# EAGLE design Ponte_H_L293E (EAGLE 9.6.2)

## Sheet 1 of 2
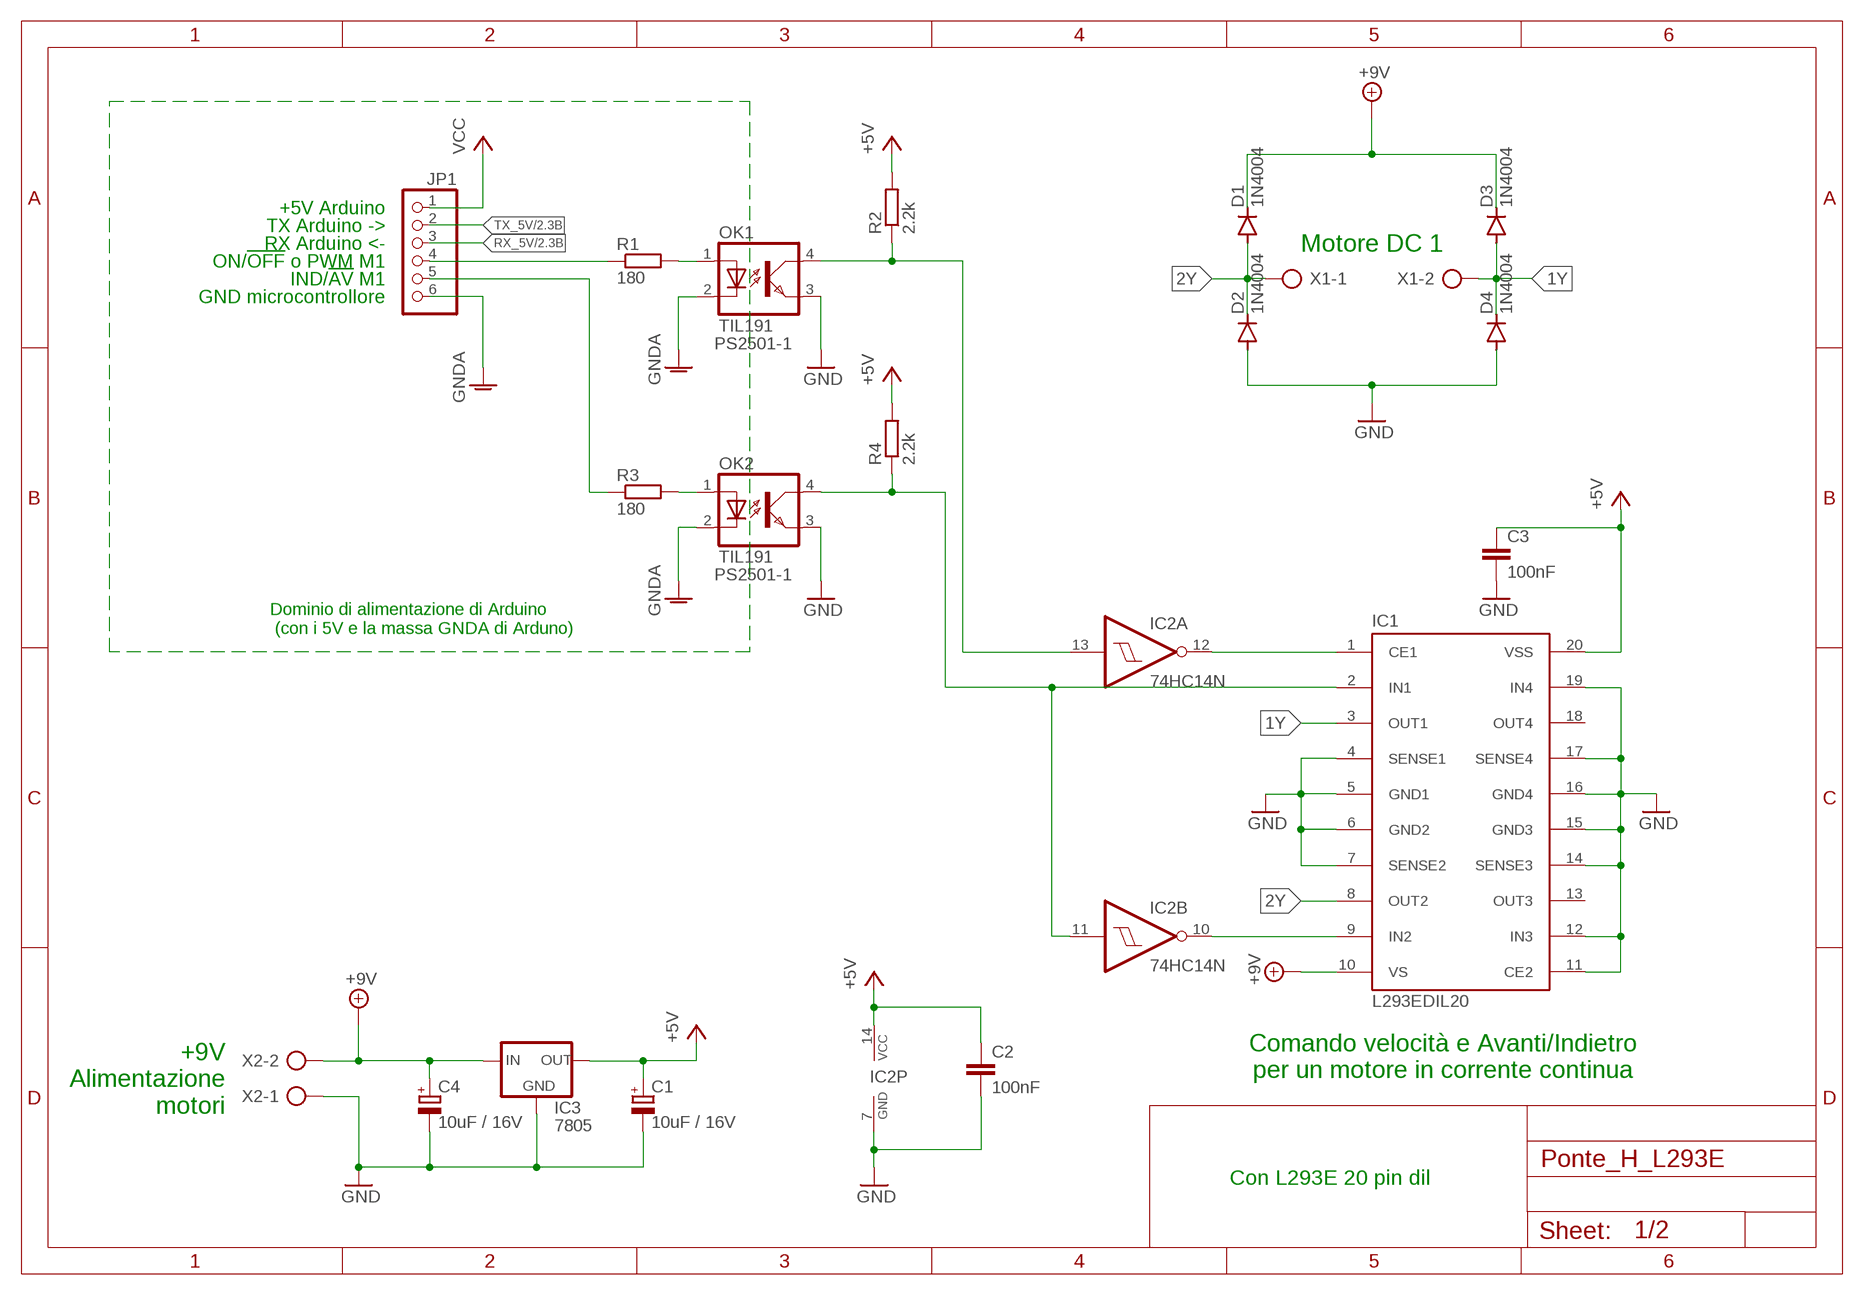
[diagram p0: schematic, sheet 1]

### Parts
C1  10uF / 16V  CPOL-EUE5-8.5  [E5-8,5]
C2  100nF  C-EU050-025X075  [C050-025X075]
C3  100nF  C-EU050-025X075  [C050-025X075]
C4  10uF / 16V  CPOL-EUE5-8.5  [E5-8,5]
D1  1N4004  [DO41-10]
D2  1N4004  [DO41-10]
D3  1N4004  [DO41-10]
D4  1N4004  [DO41-10]
IC1  L293EDIL20  [DIL20]
IC2  74HC14N  [DIL14]
IC3  7805  78XXS  [78XXS]
JP1  PINHD-1X6  [1X06]
OK1  TIL191  [DIL04]
OK2  TIL191  [DIL04]
R1  180  R-EU_0207/10  [0207/10]
R2  2.2k  R-EU_0207/10  [0207/10]
R3  180  R-EU_0207/10  [0207/10]
R4  2.2k  R-EU_0207/10  [0207/10]
X1  AK500/2  [AK500/2]
X2  AK500/2  [AK500/2]

### Nets
1Y [pwr]: D3.A D4.C IC1.3(OUT1) X1.2
2Y [pwr]: D1.A D2.C IC1.8(OUT2) X1.1
+5V [aa]: C1.+ C2.1 C3.1 IC1.20(VSS) IC2.14(P:VCC) IC3.OUT R2.2 R4.2
+9V [pwr]: C4.+ D1.C D3.C IC1.10(VS) IC3.IN X2.2
GND [pwr]: C1.- C2.2 C3.2 C4.- D2.A D4.A IC1.4(SENSE1) IC1.5(GND1) IC1.6(GND2) IC1.7(SENSE2) IC1.11(CE2) IC1.12(IN3) IC1.14(SENSE3) IC1.15(GND3) IC1.16(GND4) IC1.17(SENSE4) IC1.19(IN4) IC2.7(P:GND) IC3.GND OK1.3(EMIT) OK2.3(EMIT) X2.1
GNDA: JP1.6 OK1.2(C) OK2.2(C) ; also sheet 2
I/!A!: JP1.5 R3.1
N$1: IC1.1(CE1) IC2.12(A:O)
N$2: IC1.2(IN1) IC2.11(B:I) OK2.4(COL) R4.1
N$3: OK2.1(A) R3.2
N$4: IC1.9(IN2) IC2.10(B:O)
N$5: OK1.1(A) R1.2
N$11: IC2.13(A:I) OK1.4(COL) R2.1
PWM: JP1.4 R1.1
RX_5V: JP1.3 ; also sheet 2
TX_5V: JP1.2 ; also sheet 2
VCC: JP1.1 ; also sheet 2
Unconnected: IC1.13(OUT3) IC1.18(OUT4) IC2.1(D:I) IC2.2(D:O) IC2.3(E:I) IC2.4(E:O) IC2.5(F:I) IC2.6(F:O) IC2.8(C:O) IC2.9(C:I)

### Notes on the sheet
- +5V Arduino
- TX Arduino ->
- RX Arduino <-
- Motore DC 1
- ON/!OFF! o PWM M1
- IND/!AV! M1
- GND microcontrollore
- Dominio di alimentazione di Arduino
   (con i 5V e la massa GNDA di Arduno)
- +9V
  Alimentazione
  motori
- Comando velocità e Avanti/Indietro
  per un motore in corrente continua
- Con L293E 20 pin dil

## Sheet 2 of 2
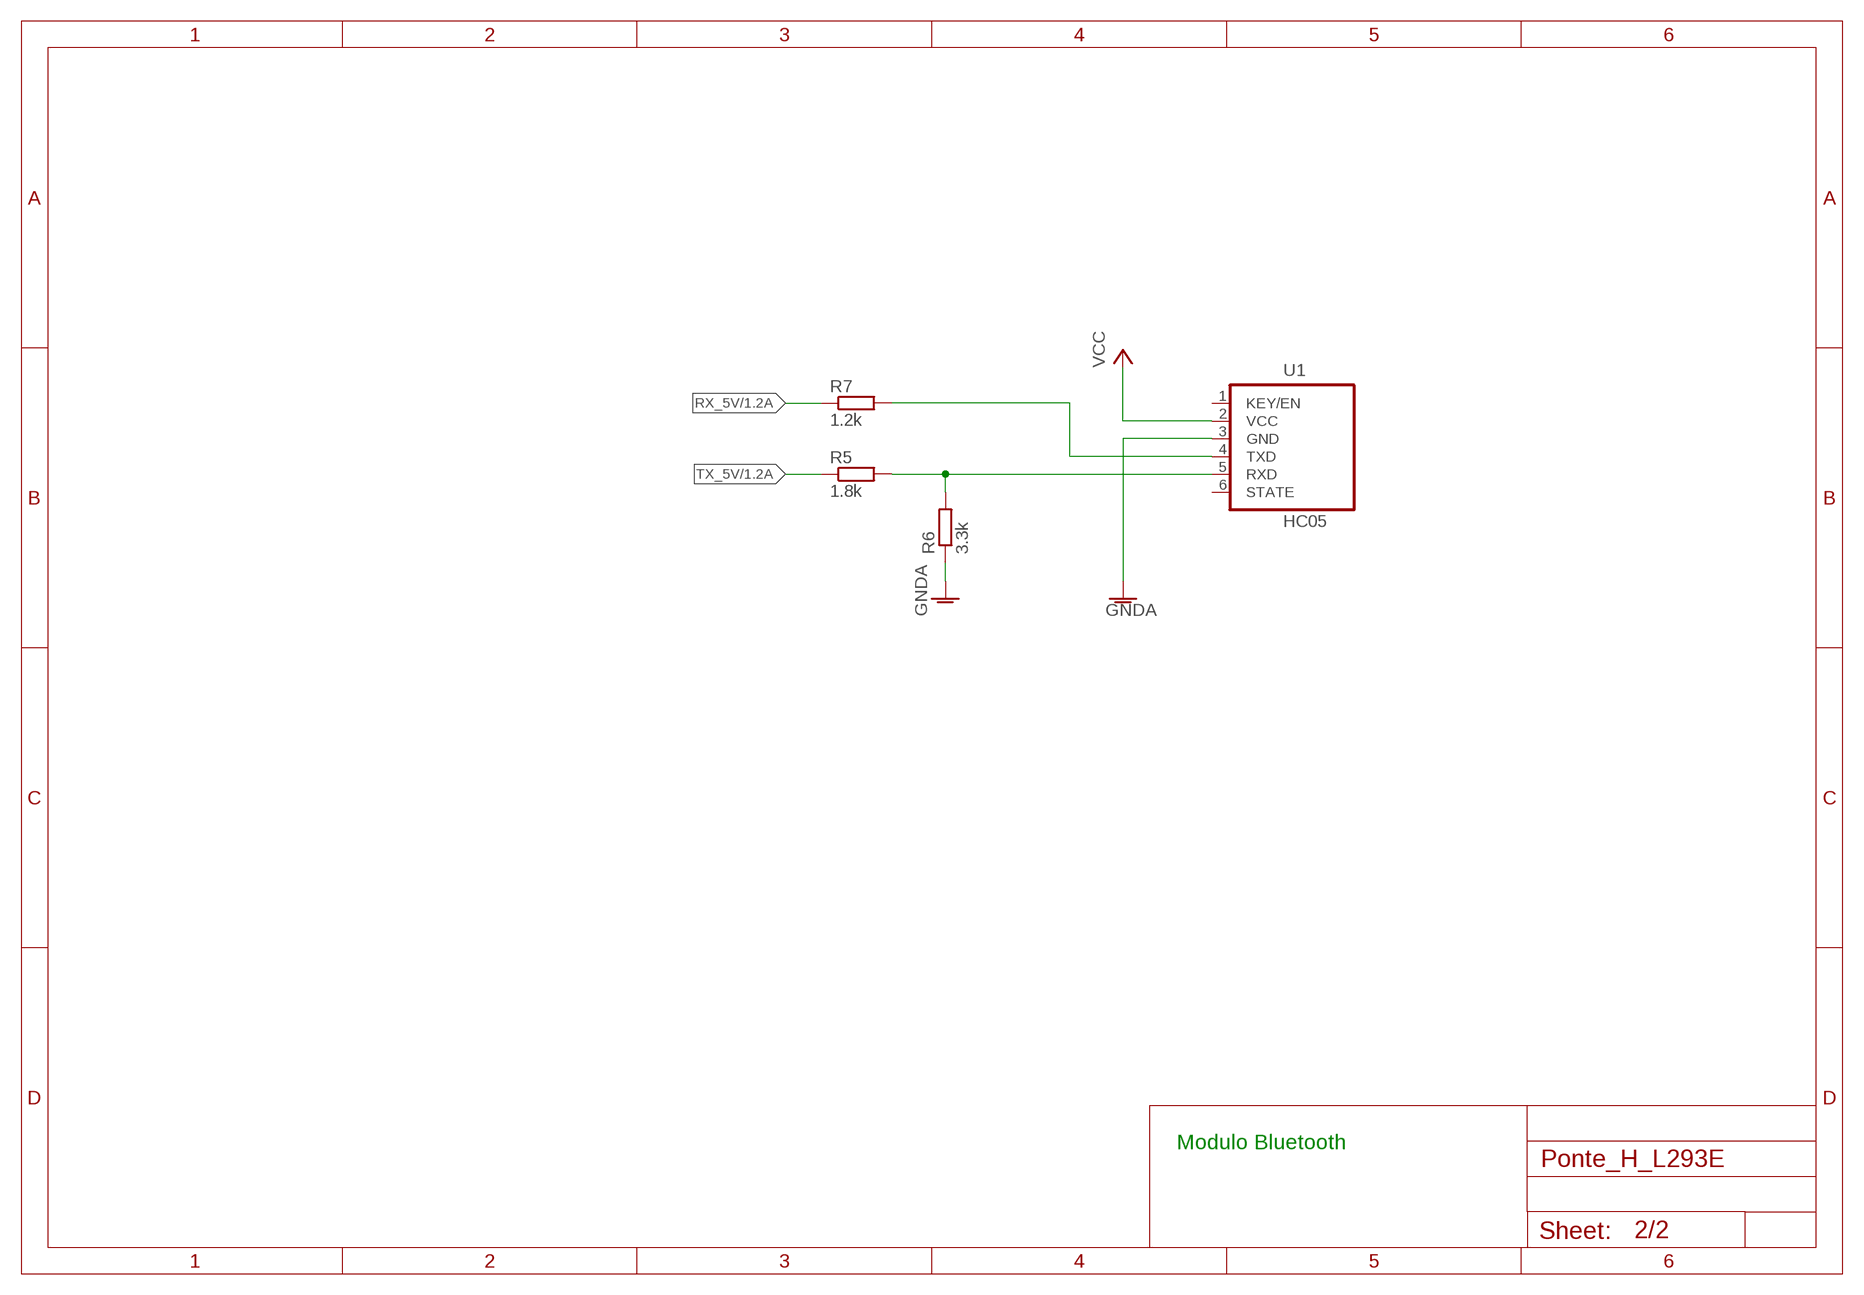
[diagram p1: schematic, sheet 2]

### Parts
R5  1.8k  R-EU_0207/10  [0207/10]
R6  3.3k  R-EU_0207/10  [0207/10]
R7  1.2k  R-EU_0207/10  [0207/10]
U1  HC05  [HC05-PIN]

### Nets
GNDA: R6.1 U1.3(GND) ; also sheet 1
N$6: R7.2 U1.4(TXD)
N$13: R5.2 R6.2 U1.5(RXD)
RX_5V: R7.1 ; also sheet 1
TX_5V: R5.1 ; also sheet 1
VCC: U1.2(VCC) ; also sheet 1
Unconnected: U1.1(KEY/EN) U1.6(STATE)

### Notes on the sheet
- Modulo Bluetooth

## Library data of the parts
C1 C4 = rcl_LargePads:CPOL-EU: POLARIZED CAPACITOR, European symbol
C2 C3 = rcl_LargePads:C-EU: CAPACITOR, European symbol
D1-D4 = diode_LargePads:1N4004: DIODE general purpose rectifier, 1 A
IC1 = L293:L293E: PUSH-PULL 4 CHANNEL DRIVER
IC2 = 74xx-eu:74*14: Hex schmitt trigger INVERTER
IC3 = v-reg_LargePads:78XXS: VOLTAGE REGULATOR
JP1 = pinhead:PINHD-1X6: PIN HEADER
OK1 OK2 = optocoupler:TIL191: TEXAS INSTRUMENTS OPTO COUPLER; ALT: PS2501-1; OC_FARNELL: 1683363; OC_NEWARK: unknown
R1-R7 = rcl_LargePads:R-EU_: RESISTOR, European symbol
U1 = HC05_HC06:HC05: HC-05 Master and slave mode can be switched. TX and RX NOT 5V tolerant.
X1 X2 = con-ptr500:AK500/2: CONNECTOR; OC_FARNELL: unknown; OC_NEWARK: unknown

## Net classes
0 default: width 0.8 mm, drill 0.6 mm, clearance 0.6 mm
1 aa: width 1 mm, drill 0.6 mm, clearance 0.8 mm to class 0, clearance 0.8 mm
2 pwr: width 1.2 mm, drill 0.8 mm, clearance 0.8 mm to class 0, clearance 0.8 mm to class 1, clearance 0.8 mm

## Board
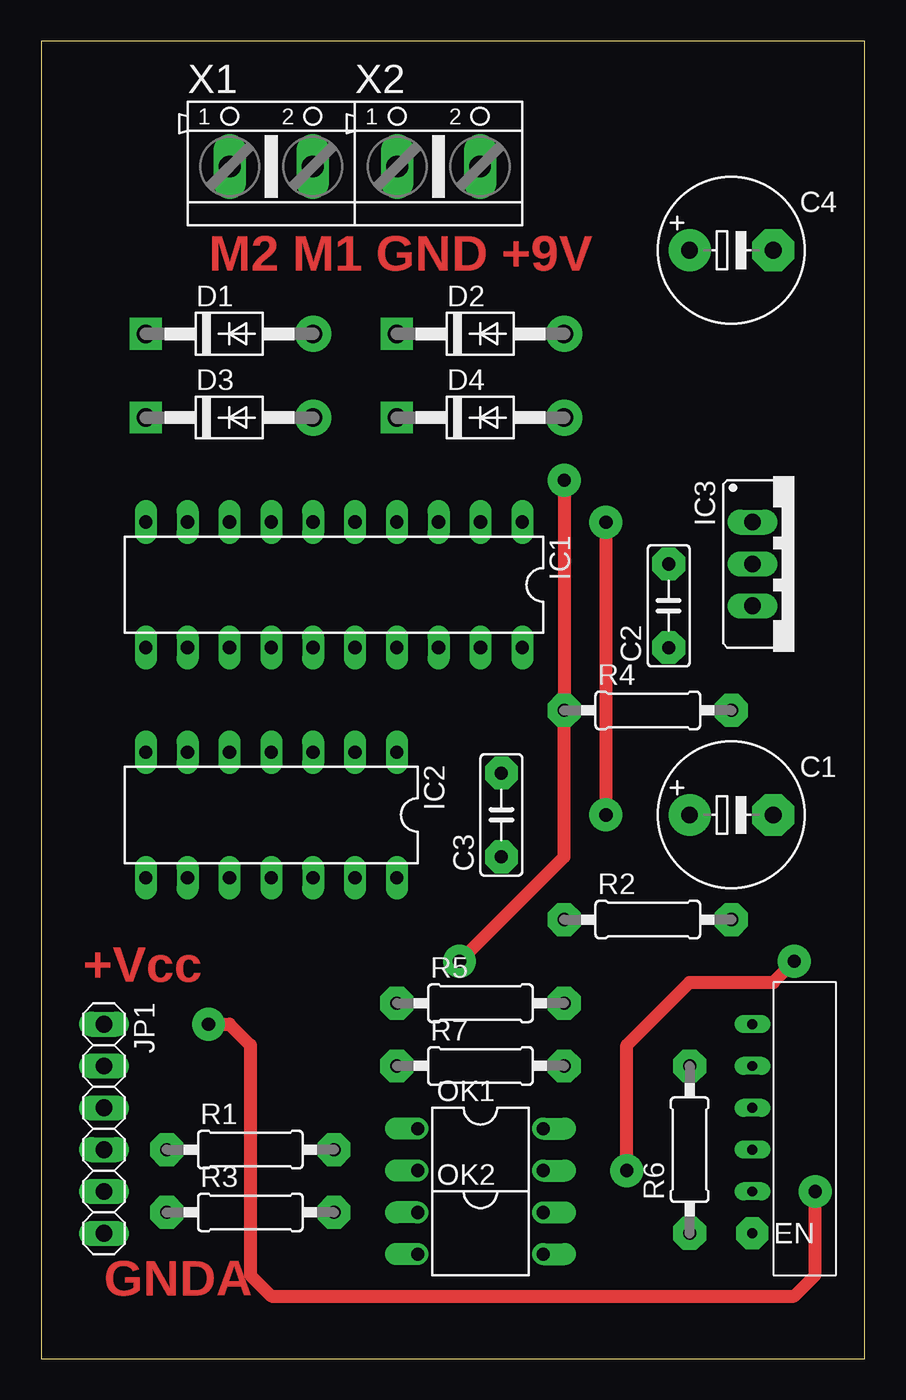
[diagram p2: board, top side]
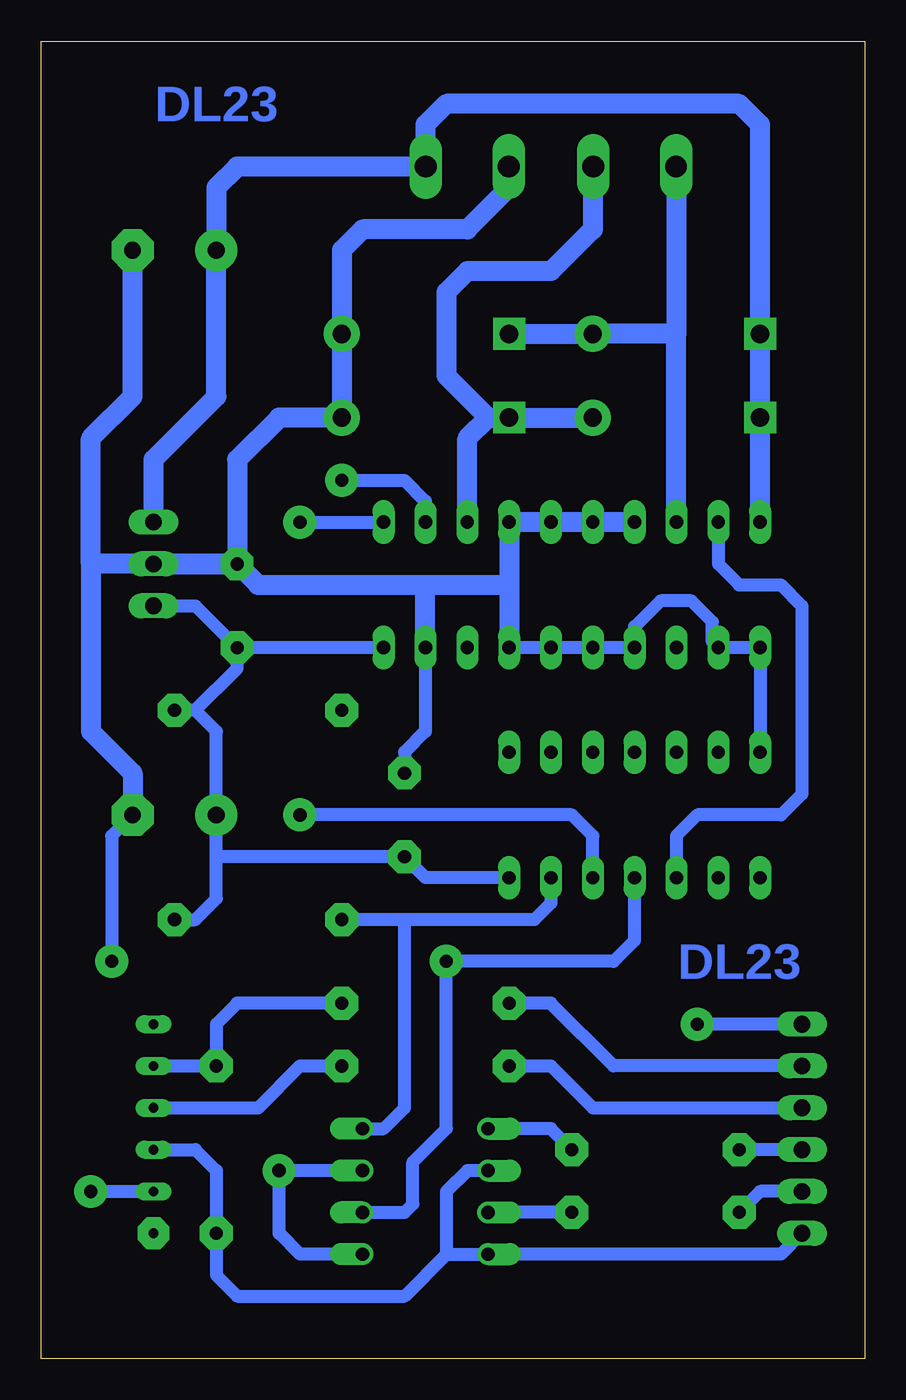
[diagram p3: board, bottom side, seen from below]

Size 50 x 80 mm. Coordinates in mm from the lower left corner, seen from the top.
Outline: 0,0 50,0 50,80 0,80 0,0
Copper layers (1*16): Top 0.035mm / dielectric 1.5mm / Bottom 0.035mm
Design rules "default": minimum track width 6mil, minimum drill 0.35mm, track to track 6mil, track to pad 6mil, pad to pad 6mil, via to via 6mil, smd to smd 6mil, copper to edge 40mil, drill to drill 6mil, minimum pad ring 10mil, minimum via ring 8mil, stop-mask expansion 4mil, vias tented up to drill 0mil, thermal gap 10mil

### Footprints (pad centres in the part's own frame; a part is rotated, then mirrored left to right if it is on the bottom)
E5-8,5 = drill 1.016 pad 2.54: + -2.54,0 | drill 1.016 pad 2.54 octagon: - 2.54,0
C050-025X075 = drill 0.8 pad 1.981 octagon: 1 -2.54,0; 2 2.54,0
DO41-10 = drill 1.118 pad 2.184: A 5.08,0 | drill 1.118 pad 1.93 square: C -5.08,0
DIL20 = drill 0.813 long: 1 -11.43,-3.81; 2 -8.89,-3.81; 3 -6.35,-3.81; 4 -3.81,-3.81; 5 -1.27,-3.81; 6 1.27,-3.81; 7 3.81,-3.81; 8 6.35,-3.81; 9 8.89,-3.81; 10 11.43,-3.81; 11 11.43,3.81; 12 8.89,3.81; 13 6.35,3.81; 14 3.81,3.81; 15 1.27,3.81; 16 -1.27,3.81; 17 -3.81,3.81; 18 -6.35,3.81; 19 -8.89,3.81; 20 -11.43,3.81
DIL14 = drill 0.813 long: 1 -7.62,-3.81; 2 -5.08,-3.81; 3 -2.54,-3.81; 4 0,-3.81; 5 2.54,-3.81; 6 5.08,-3.81; 7 7.62,-3.81; 8 7.62,3.81; 9 5.08,3.81; 10 2.54,3.81; 11 0,3.81; 12 -2.54,3.81; 13 -5.08,3.81; 14 -7.62,3.81
78XXS = drill 1.016 long: GND 0,-2.54; IN -2.54,-2.54; OUT 2.54,-2.54
1X06 = drill 1.016 long: 1 -6.35,0; 2 -3.81,0; 3 -1.27,0; 4 1.27,0; 5 3.81,0; 6 6.35,0
DIL04 = drill 0.813 offset: 1 -1.27,-3.81; 2 1.27,-3.81; 3 1.27,3.81; 4 -1.27,3.81
0207/10 = drill 0.8 pad 2 octagon: 1 -5.08,0; 2 5.08,0
HC05-PIN = drill 0.6 pad 1.93 octagon: 1 6.35,0 | drill 0.6 long: 2 3.81,0; 3 1.27,0; 4 -1.27,0; 5 -3.81,0; 6 -6.35,0
AK500/2 = drill 1.321 long: 1 -2.515,0; 2 2.515,0

### Placement (x,y rotation side)
C1  41.91,33.02 0 top
C2  38.1,45.72 90 top
C3  27.94,33.02 90 top
C4  41.91,67.31 0 top
D1  11.43,62.23 0 top
D2  26.67,62.23 0 top
D3  11.43,57.15 0 top
D4  26.67,57.15 0 top
IC1  17.78,46.99 180 top
IC2  13.97,33.02 180 top
IC3  45.72,48.26 270 top
JP1  3.81,13.97 270 top
OK1  26.67,12.7 270 top
OK2  26.67,7.62 270 top
R1  12.7,12.7 0 top
R2  36.83,26.67 0 top
R3  12.7,8.89 0 top
R4  36.83,39.37 0 top
R5  26.67,21.59 0 top
R6  39.37,12.7 90 top
R7  26.67,17.78 0 top
U1  43.18,13.97 270 top
X1  13.97,72.39 0 top
X2  24.13,72.39 0 top

### Tracks (layer width: path | path; a pad name or v marks a point on that pad's centre or on a via)
1Y
  Bottom 1.2: IC1.3 24.13,55.88 22.86,57.15 | 22.86,57.15 D4.C D3.A | X1.2 16.51,72.36 16.51,68.58 19.05,66.04 24.13,66.04 25.4,64.77 25.4,59.69 22.86,57.15
2Y
  Bottom 1.2: 11.43,62.23 11.46,62.26 X1.1 | 11.43,62.23 D1.A D2.C | IC1.8 11.43,62.23
+5V
  Bottom 0.8: IC3.OUT 40.64,45.72 C2.1 | IC2.14 26.67,29.21 C3.1 39.37,30.48 | IC1.20 C2.1 | 40.64,39.37 38.1,41.91 C2.1 | R2.2 40.64,26.67 39.37,27.94 39.37,30.48 | 39.37,30.48 C1.+ 39.37,38.1 40.64,39.37 | 40.64,39.37 R4.2
+9V
  Bottom 1.2: IC1.10 D3.C D1.C 6.35,74.93 7.62,76.2 25.4,76.2 26.67,74.93 26.67,72.42 X2.2 38.1,72.39 39.37,71.12 C4.+ 39.37,58.42 43.18,54.61 IC3.IN
GND  (via drill 0.8 pad 2)
  Top 0.8: v35.56,11.43 35.56,19.05 39.37,22.86 44.45,22.86 v45.72,24.13
  Bottom 0.8: OK2.3 34.29,6.35 35.56,7.62 v35.56,11.43 OK1.3 | IC1.17 IC1.16 IC1.15 IC1.14 13.97,44.45 12.39,46.02 10.53,46.02 9.25,44.74 9.25,43.54 IC1.12 IC1.11 IC2.7 | C1.- 45.72,31.75 v45.72,24.13 | IC1.19 26.67,38.1 27.94,36.83 C3.2
  Bottom 1.2: X2.1 21.61,71.09 24.13,68.58 30.48,68.58 31.75,67.31 D2.A D4.A 35.56,57.15 38.1,54.61 C2.2 36.83,46.99 26.67,46.99 | IC1.7 IC1.6 IC1.5 IC1.4 21.59,46.99 | 21.59,46.99 IC1.17 | 26.67,46.99 21.59,46.99 | IC1.19 26.67,46.99 | IC3.GND 46.99,48.26 | 46.99,48.26 46.99,38.1 44.45,35.56 C1.- | C4.- 44.45,58.42 46.99,55.88 46.99,48.26
  Bottom 1.27: 41.91,48.26 IC3.GND C2.2
GNDA
  Bottom 0.8: OK1.2 24.13,11.43 25.4,10.16 25.4,6.35 | 25.4,6.35 OK2.2 5.08,6.35 JP1.6 | 25.4,6.35 27.94,3.81 38.1,3.81 39.37,5.08 R6.1 39.37,11.43 40.64,12.7 U1.3
I/!A!
  Bottom 0.8: JP1.5 6.35,10.16 R3.1
N$1  (via drill 0.8 pad 2)
  Top 0.8: v34.29,50.8 v34.29,33.02
  Bottom 0.8: IC2.12 16.51,31.75 17.78,33.02 v34.29,33.02 | v34.29,50.8 IC1.1
N$2  (via drill 0.8 pad 2)
  Top 0.8: v25.4,24.13 31.75,30.48 R4.1 v31.75,53.34
  Bottom 0.8: OK2.4 27.94,8.89 27.43,9.4 27.43,11.94 25.4,13.97 v25.4,24.13 15.24,24.13 13.97,25.4 IC2.11 | IC1.2 26.67,52.07 27.94,53.34 v31.75,53.34
N$3
  Bottom 0.8: R3.2 OK2.1
N$4
  Bottom 0.8: IC1.9 8.89,48.26 7.62,46.99 5.08,46.99 3.81,45.72 3.81,34.29 5.08,33.02 10.16,33.02 11.43,31.75 IC2.10
N$5
  Bottom 0.8: R1.2 19.05,13.97 OK1.1
N$6
  Bottom 0.8: U1.4 36.83,15.24 34.29,17.78 R7.2
N$11
  Bottom 0.8: OK1.4 29.21,13.97 27.94,15.24 27.94,26.67 | 27.94,26.67 R2.1 | IC2.13 19.05,27.67 20.05,26.67 27.94,26.67
N$13
  Bottom 0.8: U1.5 R6.2 39.37,20.32 38.1,21.59 R5.2
PWM
  Bottom 0.8: JP1.4 R1.1
RX_5V
  Bottom 0.8: R7.1 19.05,17.78 16.51,15.24 JP1.3
TX_5V
  Bottom 0.8: JP1.2 15.24,17.78 19.05,21.59 R5.1
VCC  (via drill 0.8 pad 2)
  Top 0.8: v10.16,20.32 11.43,20.32 12.7,19.05 12.7,5.08 13.97,3.81 45.72,3.81 46.99,5.08 v46.99,10.16
  Bottom 0.8: JP1.1 v10.16,20.32 | v46.99,10.16 U1.2

### Text on the board
Top: M2 | M1 | GND | +9V | +Vcc | GNDA
Bottom: DL23 | DL23